# EAGLE schematic usain_bot_chasis (EAGLE 9.4.2)
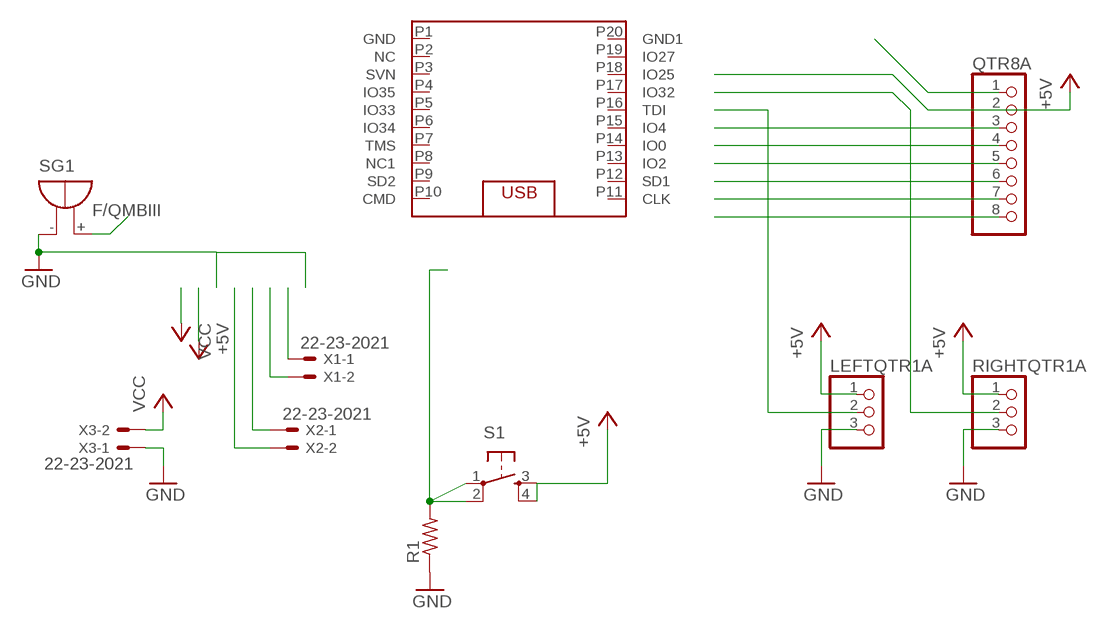
[diagram p0: schematic, sheet 1]

## Parts
LEFTQTR1A  PINHD-1X3  [1X03]
QTR8A  PINHD-1X8BIG  [1X08-BIG]
R1  R-US_0207/7  [0207/7]
RIGHTQTR1A  PINHD-1X3  [1X03]
S1  TAC_SWITCHPTH  [TACTILE-PTH]
SG1  F/QMBIII  [F/QMBIII]
U$1  ESP32_MINI_KIT  [ESP32_MINI_KIT]
X1  22-23-2021  [22-23-2021]
X2  22-23-2021  [22-23-2021]
X3  22-23-2021  [22-23-2021]

## Nets
+5V: LEFTQTR1A.1 QTR8A.2 RIGHTQTR1A.1 S1.3 S1.4
GND: LEFTQTR1A.3 R1.1 RIGHTQTR1A.3 SG1.-(+) X3.1
N$1: QTR8A.8
N$2: QTR8A.7
N$3: QTR8A.6
N$4: QTR8A.5
N$5: QTR8A.4
N$6: QTR8A.3
N$7: QTR8A.1
N$8: R1.2 S1.1 S1.2
N$17: X2.2
N$18: X2.1
N$19: X1.2
N$20: X1.1
N$21: SG1.+(-)
N$22: LEFTQTR1A.2
N$23: RIGHTQTR1A.2
VCC: X3.2
Unconnected: U$1.P1(GND) U$1.P2(NC) U$1.P3(SVN) U$1.P4(IO35) U$1.P5(IO33) U$1.P6(IO34) U$1.P7(TMS) U$1.P8(NC1) U$1.P9(SD2) U$1.P10(CMD) U$1.P11(CLK) U$1.P12(SD1) U$1.P13(IO2) U$1.P14(IO0) U$1.P15(IO4) U$1.P16(TDI) U$1.P17(IO32) U$1.P18(IO25) U$1.P19(IO27) U$1.P20(GND1)

## Library data of the parts
LEFTQTR1A RIGHTQTR1A = adafruit:PINHD-1X3: PIN HEADER
QTR8A = adafruit:PINHD-1X8: PIN HEADER
R1 = resistor:R-US_: RESISTOR, American symbol
S1 = SparkFun-Retired:TAC_SWITCH: Momentary Switch Button commonly used for reset or general input. Spark Fun Electronics SKU : COM-00097 SMT- SWCH-08247
SG1 = buzzer:F/QMBIII: BUZZER Source: Buerklin; OC_FARNELL: unknown; OC_NEWARK: unknown
U$1 = dedo:ESP32_MINI_KIT
X1-X3 = con-molex:22-23-2021: .100" (2.54mm) Center Header - 2 Pin; MF: MOLEX; MPN: 22-23-2021; OC_FARNELL: 1462926; OC_NEWARK: 25C3832